# EAGLE schematic with_solar (EAGLE 9.4.2)
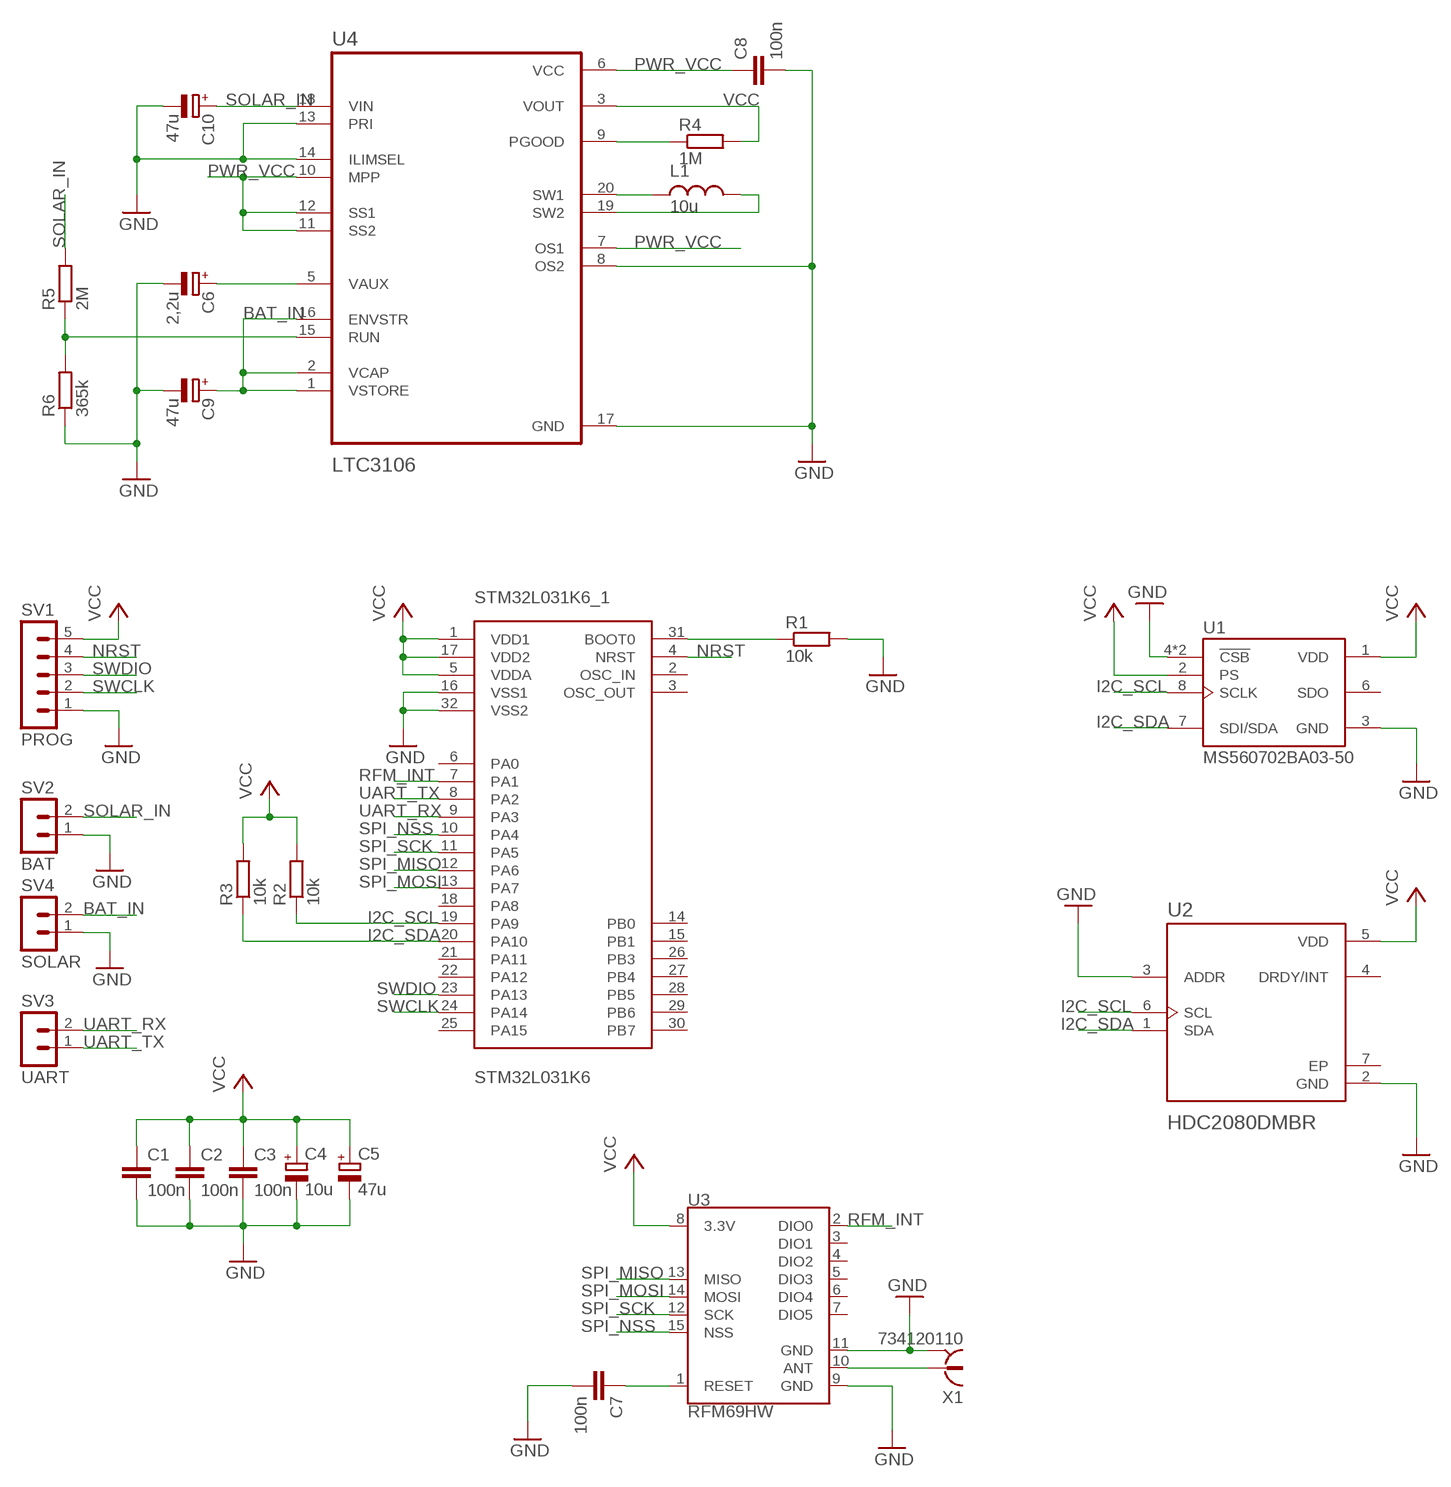
[diagram p0: schematic, sheet 1]

## Parts
C1  100n  C-EUC1206  [C1206]
C2  100n  C-EUC1206  [C1206]
C3  100n  C-EUC1206  [C1206]
C4  10u  CPOL-EUUD-4X5,8  [UD-4X5,8_NICHICON]
C5  47u  CPOL-EUUD-4X5,8  [UD-4X5,8_NICHICON]
C6  2,2u  CPOL-EUUD-4X5,8  [UD-4X5,8_NICHICON]
C7  100n  C-EUC1206  [C1206]
C8  100n  C-EUC1206  [C1206]
C9  47u  CPOL-EUUD-4X5,8  [UD-4X5,8_NICHICON]
C10  47u  CPOL-EUUD-4X5,8  [UD-4X5,8_NICHICON]
L1  10u  L1210  [R1210]
R1  10k  R-EU_R0805  [R0805]
R2  10k  R-EU_R0805  [R0805]
R3  10k  R-EU_R0805  [R0805]
R4  1M  R-EU_R0805  [R0805]
R5  2M  R-EU_R0805  [R0805]
R6  365k  R-EU_R0805  [R0805]
STM32L031K6_1  STM32L031K6  [LQFP32-7X7]
SV1  PROG  MA05-1  [MA05-1]
SV2  BAT  MA02-1  [MA02-1]
SV3  UART  MA02-1  [MA02-1]
SV4  SOLAR  MA02-1  [MA02-1]
U1  MS560702BA03-50  [SON125P300X500X100-8N]
U2  HDC2080DMBR  [SON100P300X300X80-7N]
U3  RFM69HW  [RFM69W-XXXS2]
U4  LTC3106  [LTC3106]
X1  734120110  [734120110]

## Nets
BAT_IN: C9.+ SV4.2 U4.1(VSTORE) U4.2(VCAP) U4.16(ENVSTR)
GND: C1.2 C2.2 C3.2 C4.- C5.- C6.- C7.2 C8.2 C9.- C10.- R1.2 R6.1 STM32L031K6_1.16(VSS1) STM32L031K6_1.32(VSS2) SV1.1 SV2.1 SV4.1 U1.3(GND) U1.4(!CSB) U1.5(!CSB) U2.2(GND) U2.3(ADDR) U3.9(GND) U3.11(GND) U4.8(OS2) U4.13(PRI) U4.14(ILIMSEL) U4.17(GND) X1.S@1 X1.S@2 X1.S@3
I2C_SCL: R2.1 STM32L031K6_1.19(PA9) U1.8(SCLK) U2.6(SCL)
I2C_SDA: R3.1 STM32L031K6_1.20(PA10) U1.7(SDI/SDA) U2.1(SDA)
N$1: R1.1 STM32L031K6_1.31(BOOT0)
N$2: U3.10(ANT) X1.1
N$3: L1.1 U4.20(SW1)
N$4: L1.2 U4.19(SW2)
N$5: C6.+ U4.5(VAUX)
N$6: R4.1 U4.9(PGOOD)
N$7: R5.1 R6.2 U4.15(RUN)
N$10: C7.1 U3.1(RESET)
NRST: STM32L031K6_1.4(NRST) SV1.4
PWR_VCC: C8.1 U4.6(VCC) U4.7(OS1) U4.10(MPP) U4.11(SS2) U4.12(SS1)
RFM_INT: STM32L031K6_1.7(PA1) U3.2(DIO0)
SOLAR_IN: C10.+ R5.2 SV2.2 U4.18(VIN)
SPI_MISO: STM32L031K6_1.12(PA6) U3.13(MISO)
SPI_MOSI: STM32L031K6_1.13(PA7) U3.14(MOSI)
SPI_NSS: STM32L031K6_1.10(PA4) U3.15(NSS)
SPI_SCK: STM32L031K6_1.11(PA5) U3.12(SCK)
SWCLK: STM32L031K6_1.24(PA14) SV1.2
SWDIO: STM32L031K6_1.23(PA13) SV1.3
UART_RX: STM32L031K6_1.9(PA3) SV3.2
UART_TX: STM32L031K6_1.8(PA2) SV3.1
VCC: C1.1 C2.1 C3.1 C4.+ C5.+ R2.2 R3.2 R4.2 STM32L031K6_1.1(VDD1) STM32L031K6_1.5(VDDA) STM32L031K6_1.17(VDD2) SV1.5 U1.1(VDD) U1.2(PS) U2.5(VDD) U3.8(3.3V) U4.3(VOUT)
Unconnected: STM32L031K6_1.2(OSC_IN) STM32L031K6_1.3(OSC_OUT) STM32L031K6_1.6(PA0) STM32L031K6_1.14(PB0) STM32L031K6_1.15(PB1) STM32L031K6_1.18(PA8) STM32L031K6_1.21(PA11) STM32L031K6_1.22(PA12) STM32L031K6_1.25(PA15) STM32L031K6_1.26(PB3) STM32L031K6_1.27(PB4) STM32L031K6_1.28(PB5) STM32L031K6_1.29(PB6) STM32L031K6_1.30(PB7) U1.6(SDO) U2.4(DRDY/INT) U2.7(EP) U3.3(DIO1) U3.4(DIO2) U3.5(DIO3) U3.6(DIO4) U3.7(DIO5)

## Library data of the parts
C1-C3 C7 C8 = rcl:C-EU: CAPACITOR, European symbol; SPICEPREFIX: C
C4-C6 C9 C10 = rcl:CPOL-EU: POLARIZED CAPACITOR, European symbol; SPICEPREFIX: C
L1 = dp:L1210
R1-R6 = rcl:R-EU_: RESISTOR, European symbol; SPICEPREFIX: R
STM32L031K6_1 = dp:STM32L031K6
SV1 = con-lstb:MA05-1: PIN HEADER; OC_FARNELL: unknown; OC_NEWARK: unknown
SV2-SV4 = dp:MA02-1
U1 = MS560702BA03-50:MS560702BA03-50: BAROMETRIC PRESSURE SENSOR; AVAILABILITY: Unavailable; COMMENT: MS560702BA03-50; DESCRIPTION: MS5607-02BA03 Series 3 V 1 to 120 kPa Absolute Barometric Pressure Sensor; EU_ROHS_COMPLIANCE: Compliant; MF: TE Connectivity; MP: MS560702BA03-50; PACKAGE: SMD-8 TE Connectivity; PRICE: None; TE_PURCHASE_URL: https://www.te.com/usa-en/product-MS560702BA03-50.html?te_bu=Cor&te_type=disp&te_campaign=seda_glo_cor-seda-global-disp-prtnr-fy19-seda-model-bom-cta_sma-317_1&elqCampaignId=32493
U2 = HDC2080DMBR2:HDC2080DMBR: Low Power Humidity and Temperature Digital Sensor 6-WSON -40 to 85; AVAILABILITY: Unavailable; DESCRIPTION: Board Mount Humidity Sensors Low Power Humidity and Temperature Digital Sensor 6-WSON -40 to 85.; MF: Texas Instruments; MP: HDC2080DMBR; PACKAGE: WDFN-6 Texas Instruments; PRICE: None
U3 = SparkFun-RF:RFM69H: Hope RF RFM69H ISM Transceiver Module The RFM69H is a transceiver module capable of operation over a wide frequency range, including the 315,433,868 and 915MHz license-free ISM (Industry Scientific and Medical) frequency bands. All major RF communication parameters are programmable and most of them can be dynamically set. The RFM69H offers the unique advantage of programmable narrow-band and wide- band communication modes. The RFM69H is optimized for low power consumption while offering high RF output power and channelized operation.Compliance ETSI and FCC regulations. Datasheet <http://www.hoperf.cn/upload/docs/RF/SX/RFM69H_DataSheet_v1.3.pdf> SparkFun Products RFM69HCW Wireless Transceiver - 915MHz <https://www.sparkfun.com/products/13909> (COM-13909) RFM69HCW Wireless Transceiver - 434MHz <https://www.sparkfun.com/products/13910> (COM-13910) SparkFun RFM69 Breakout (915MHz) <https://www.sparkfun.com/products/12775> (WRL-12775) SparkFun RFM69 Breakout (434MHz) <https://www.sparkfun.com/products/12823> (WRL-12823)
U4 = LTC3106:LTC3106
X1 = con-coax:734120110: MICRO COAXIAL CONNECTOR RECEPTACLE VERTICAL Source: Data sheet <http://www.molex.com/pdm_docs/sd/734120110_sd.pdf>